# EAGLE design sweep board (EAGLE 8.4.3)
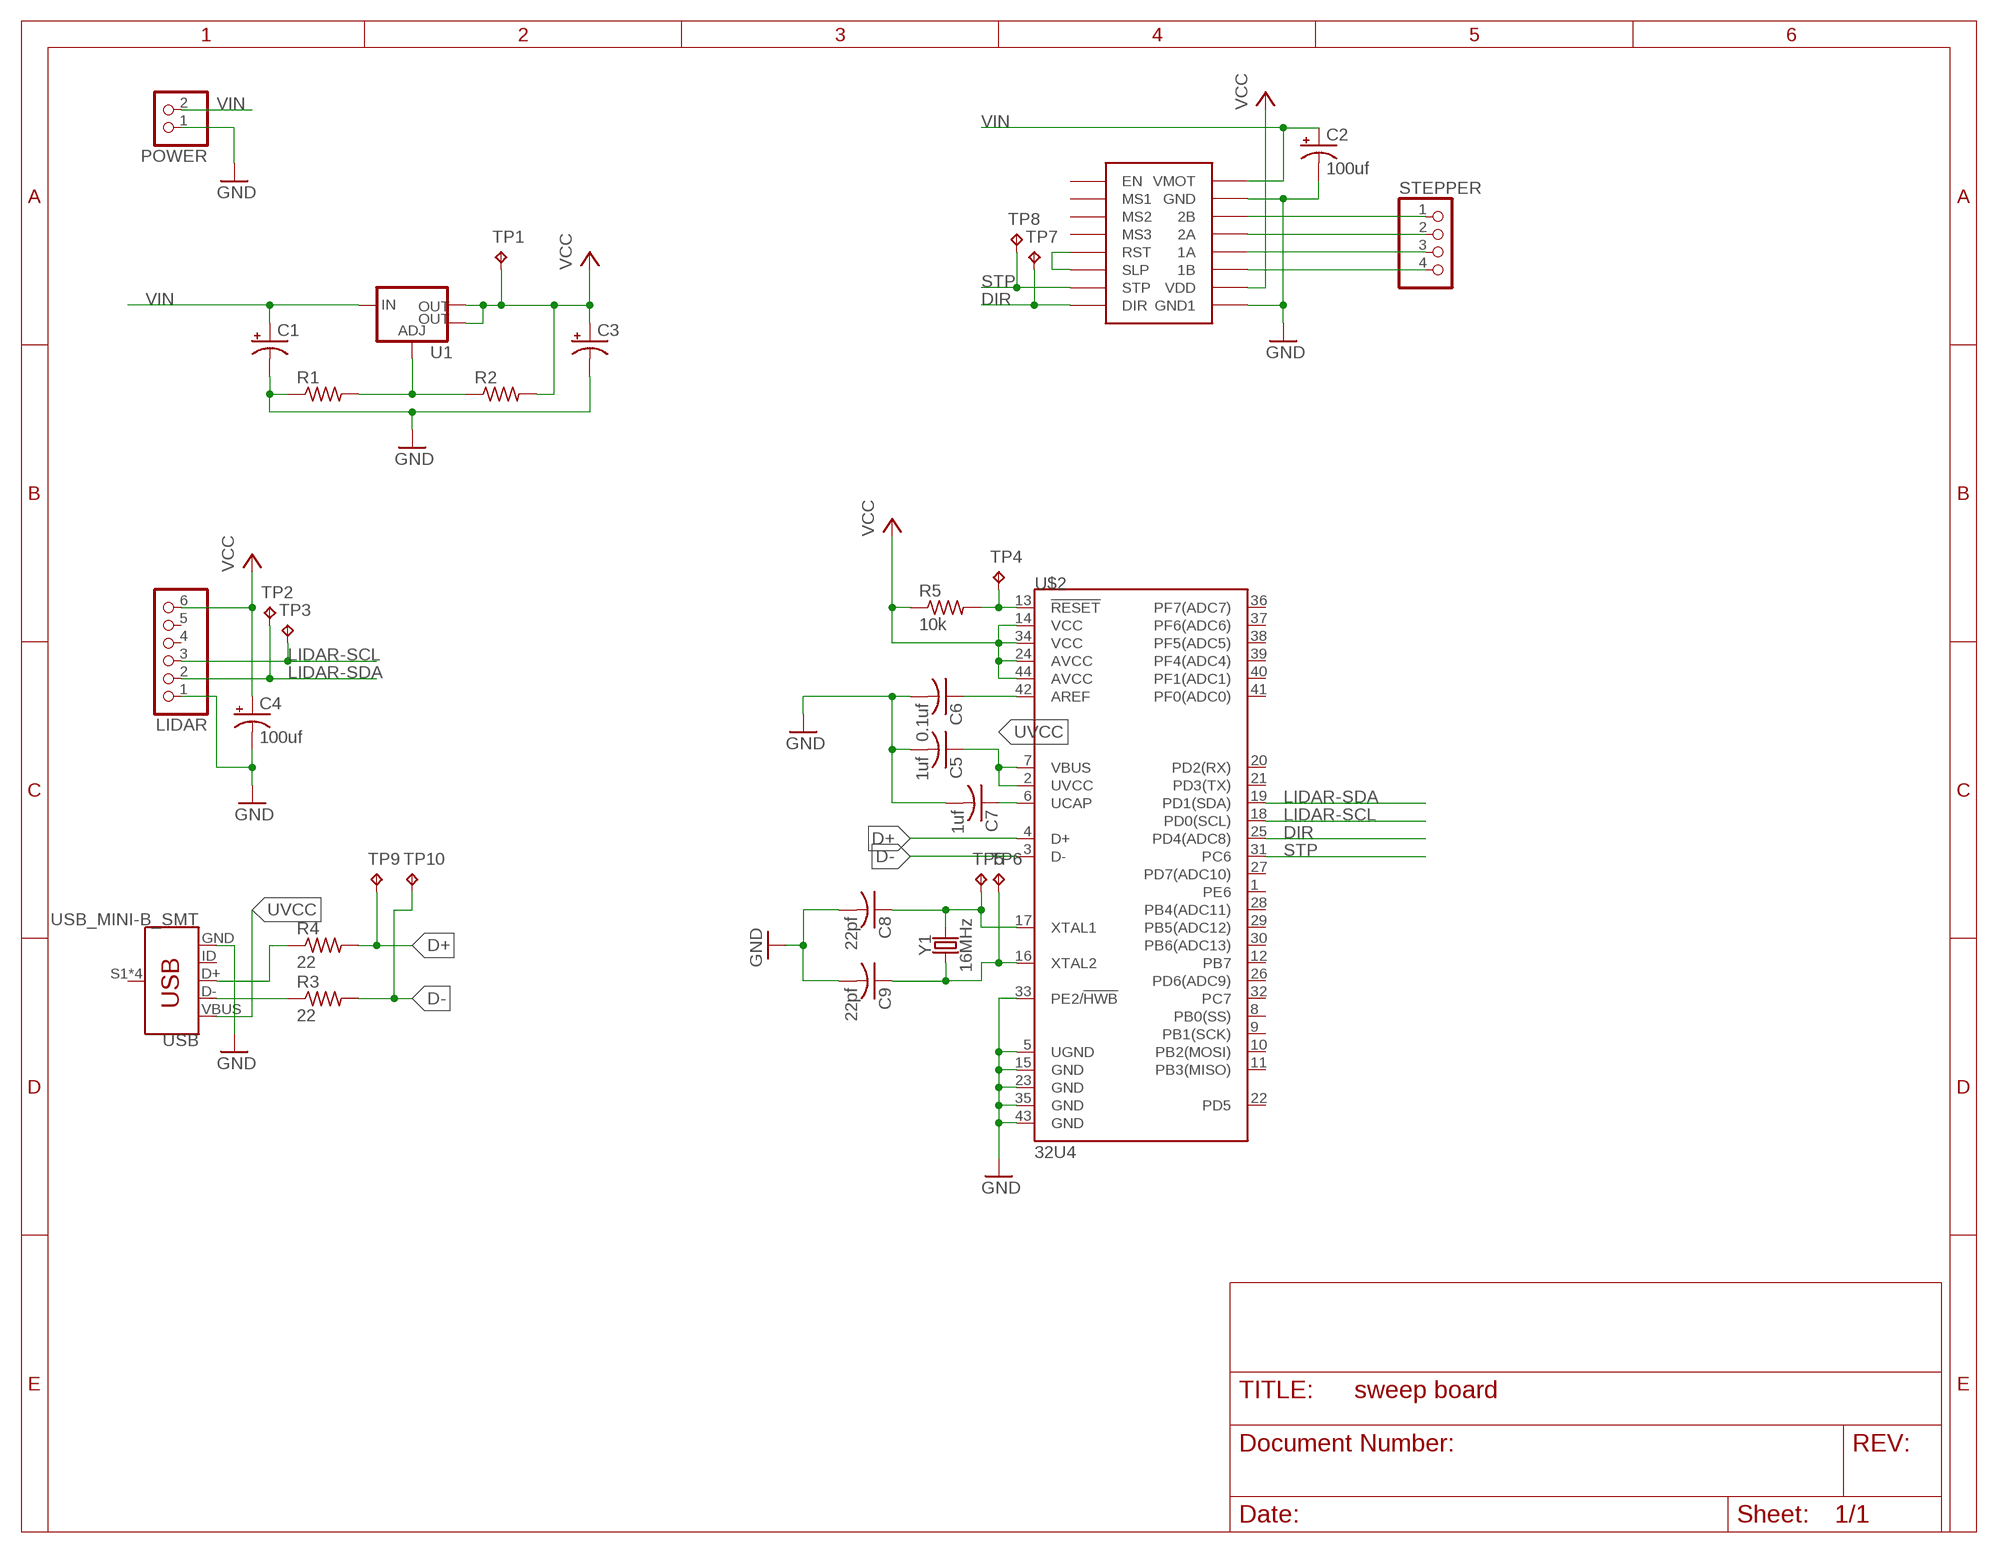
[diagram p0: schematic, sheet 1]

## Parts
C1  CPOL-USE2-5  [E2-5]
C2  100uf  CPOL-USE3.5-8  [E3,5-8]
C3  CPOL-USE3.5-8  [E3,5-8]
C4  100uf  CPOL-USE3.5-8  [E3,5-8]
C5  1uf  C-USC0603  [C0603]
C6  0.1uf  C-USC0603  [C0603]
C7  1uf  C-USC0603  [C0603]
C8  22pf  C-USC0603  [C0603]
C9  22pf  C-USC0603  [C0603]
LIDAR  PINHD-1X6  [1X06]
POWER  PINHD-1X2  [1X02]
R1  R-US_R0603  [R0603]
R2  R-US_R0603  [R0603]
R3  22  R-US_R0603  [R0603]
R4  22  R-US_R0603  [R0603]
R5  10k  R-US_R0603  [R0603]
STEPPER  PINHD-1X4  [1X04]
TP1  TPB1,27  [B1,27]
TP2  TPB1,27  [B1,27]
TP3  TPB1,27  [B1,27]
TP4  TPB1,27  [B1,27]
TP5  TPB1,27  [B1,27]
TP6  TPB1,27  [B1,27]
TP7  TPB1,27  [B1,27]
TP8  TPB1,27  [B1,27]
TP9  TPB1,27  [B1,27]
TP10  TPB1,27  [B1,27]
U1  V_REG_LM1117SOT223  [SOT223]
U$1  A4988  [A4988]
U$2  32U4  ATMEGA32U4TQFP-44  [TQFP44]
USB  USB_MINI-B_SMT  [USB-MINIB]
Y1  16MHz  CRYSTAL-16MHZSMD-5X3.2  [CRYSTAL-SMD-5X3.2-4PAD]

## Nets
D+: R4.2 TP9.TP U$2.4(D+)
D-: R3.2 TP10.TP U$2.3(D-)
DIR: TP7.TP U$1.P$8(DIR) U$2.25(PD4(ADC8))
GND: C1.- C2.- C3.- C4.- C5.2 C6.2 C7.2 C8.2 C9.2 LIDAR.1 POWER.1 R1.1 U$1.P$10(GND) U$1.P$16(GND1) U$2.5(UGND) U$2.15(GND) U$2.23(GND) U$2.33(PE2/!HWB) U$2.35(GND) U$2.43(GND) USB.GND
LIDAR-SCL: LIDAR.3 TP3.TP U$2.18(PD0(SCL))
LIDAR-SDA: LIDAR.2 TP2.TP U$2.19(PD1(SDA))
N$1: U$1.P$5(RST) U$1.P$6(SLP)
N$5: STEPPER.4 U$1.P$14(1B)
N$6: STEPPER.3 U$1.P$13(1A)
N$7: STEPPER.2 U$1.P$12(2A)
N$8: STEPPER.1 U$1.P$11(2B)
N$9: R3.1 USB.D-
N$10: R4.1 USB.D+
N$11: R1.2 R2.1 U1.1(ADJ)
N$12: R5.2 TP4.TP U$2.13(!RESET)
N$13: C6.1 U$2.42(AREF)
N$14: C7.1 U$2.6(UCAP)
N$15: C9.1 TP6.TP U$2.16(XTAL2) Y1.1
N$18: C8.1 TP5.TP U$2.17(XTAL1) Y1.3
STP: TP8.TP U$1.P$7(STP) U$2.31(PC6)
UVCC: C5.1 U$2.2(UVCC) U$2.7(VBUS) USB.VBUS
VCC: C3.+ C4.+ LIDAR.6 R2.2 R5.1 TP1.TP U1.2(OUT) U1.4(OUT) U$1.P$15(VDD) U$2.14(VCC) U$2.24(AVCC) U$2.34(VCC) U$2.44(AVCC)
VIN: C1.+ C2.+ POWER.2 U1.3(IN) U$1.P$9(VMOT)
Unconnected: LIDAR.4 LIDAR.5 U$1.P$1(EN) U$1.P$2(MS1) U$1.P$3(MS2) U$1.P$4(MS3) U$2.1(PE6) U$2.8(PB0(SS)) U$2.9(PB1(SCK)) U$2.10(PB2(MOSI)) U$2.11(PB3(MISO)) U$2.12(PB7) U$2.20(PD2(RX)) U$2.21(PD3(TX)) U$2.22(PD5) U$2.26(PD6(ADC9)) U$2.27(PD7(ADC10)) U$2.28(PB4(ADC11)) U$2.29(PB5(ADC12)) U$2.30(PB6(ADC13)) U$2.32(PC7) U$2.36(PF7(ADC7)) U$2.37(PF6(ADC6)) U$2.38(PF5(ADC5)) U$2.39(PF4(ADC4)) U$2.40(PF1(ADC1)) U$2.41(PF0(ADC0)) USB.ID USB.S1(SHIELD) USB.S2(SHIELD) USB.S3(SHIELD) USB.S4(SHIELD)

## Library data of the parts
C1-C4 = rcl:CPOL-US: POLARIZED CAPACITOR, American symbol; SPICEPREFIX: C
C5-C9 = rcl:C-US: CAPACITOR, American symbol; SPICEPREFIX: C
LIDAR = pinhead:PINHD-1X6: PIN HEADER
POWER = pinhead:PINHD-1X2: PIN HEADER
R1-R5 = rcl:R-US_: RESISTOR, American symbol; SPICEPREFIX: R
STEPPER = pinhead:PINHD-1X4: PIN HEADER
TP1-TP10 = testpad:TP: Test pad
U1 = SparkFun-IC-Power:V_REG_LM1117: Voltage Regulator LM1117 Standard adjustable voltage regulator but in SMD form. Spark Fun Electronics SKU : COM-00595; PROD_ID: VREG-08170
U$1 = JetsonProj:A4988
U$2 = SparkFun-IC-Microcontroller:ATMEGA32U4: Atmel MCU, 32KByte Atmel 44-pin 8-bit Microcontroller with 32KBytes of ISP Flash and USB Controller Datasheet <http://cdn.sparkfun.com/datasheets/Dev/Arduino/Boards/ATMega32U4.pdf> SparkFun Products LilyPad Arduino USB - ATmega32U4 Board <https://www.sparkfun.com/products/12049> (DEV-12049) Pro Micro - 5V/16MHz <https://www.sparkfun.com/products/12640> (DEV-12640) Pro Micro - 3.3V/8MHz <https://www.sparkfun.com/products/12587> (DEV-12587) Fio v3 - ATmega32U4 <https://www.sparkfun.com/products/11520> (DEV-11520) Qduino Mini <https://www.sparkfun.com/products/13614> (DEV-13614) Makey Makey - Standard Kit <https://www.sparkfun.com/products/11511> (WIG-11511) Makey Makey Deluxe Kit <https://www.sparkfun.com/products/11519> (WIG-11519); PROD_ID: IC-11161
USB = SparkFun-Connectors:USB_MINI-B: USB type Mini-B Connector Breaks out 5th pin, and includes shield pins if needed. SparkFun Products: SparkFun FTDI Basic Breakout <https://www.sparkfun.com/products/9716> SparkFun XBee Explorer USB <https://www.sparkfun.com/products/11812> SparkFun Redboard <https://www.sparkfun.com/products/12757>; PROD_ID: CONN-08193; SF_ID: PRT-00587
Y1 = SparkFun-Clocks:CRYSTAL-16MHZ: 16MHz Crystal Digikey Example <http://www.digikey.com/product-search/en?keywords=535-9122-1-ND> Frequency: 16MHz Frequency Stability: ±50ppm Frequency Tolerance: ±20ppm Load Capacitance: 18pF SparkFun Products: Pro Micro -5V/16MHz <https://www.sparkfun.com/products/12640> SparkFun Serial Enabled LCD Kit <https://www.sparkfun.com/products/10097>; PROD_ID: XTAL-08218; SF_ID: COM-00094

## Board
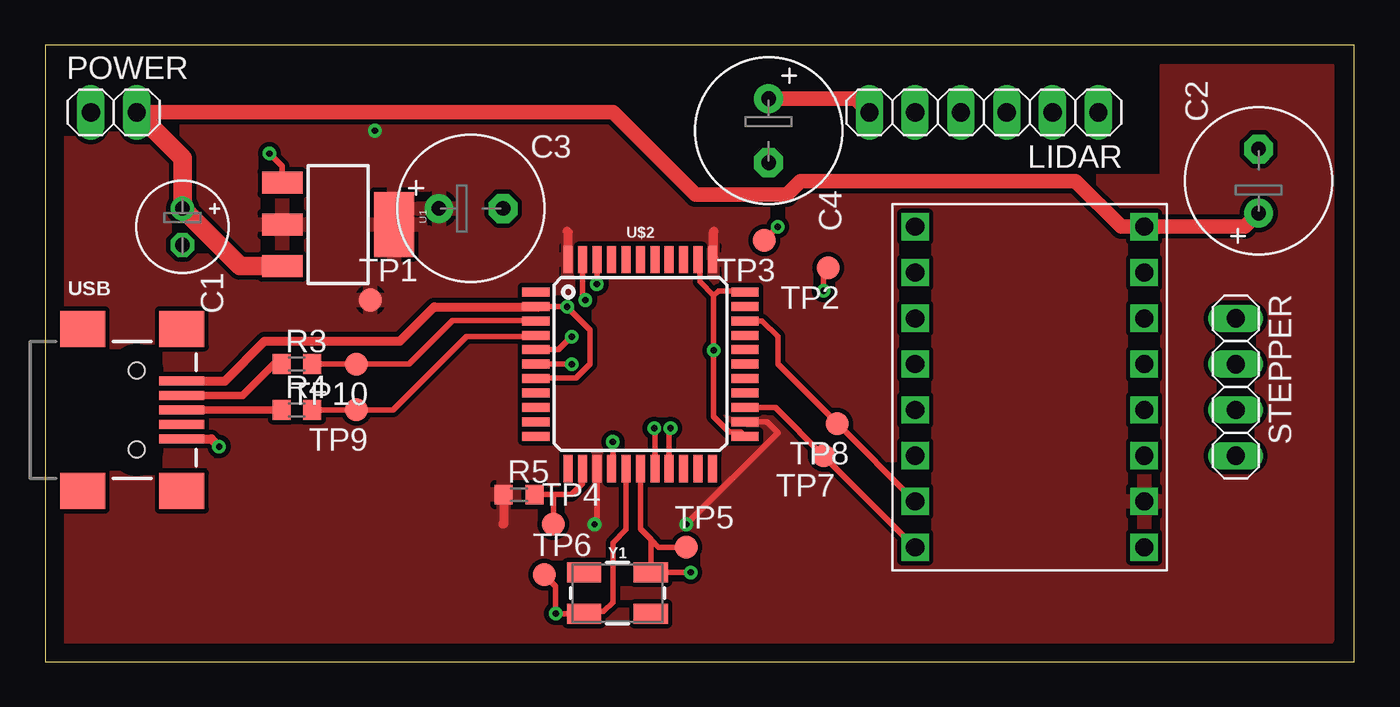
[diagram p1: board, top side]
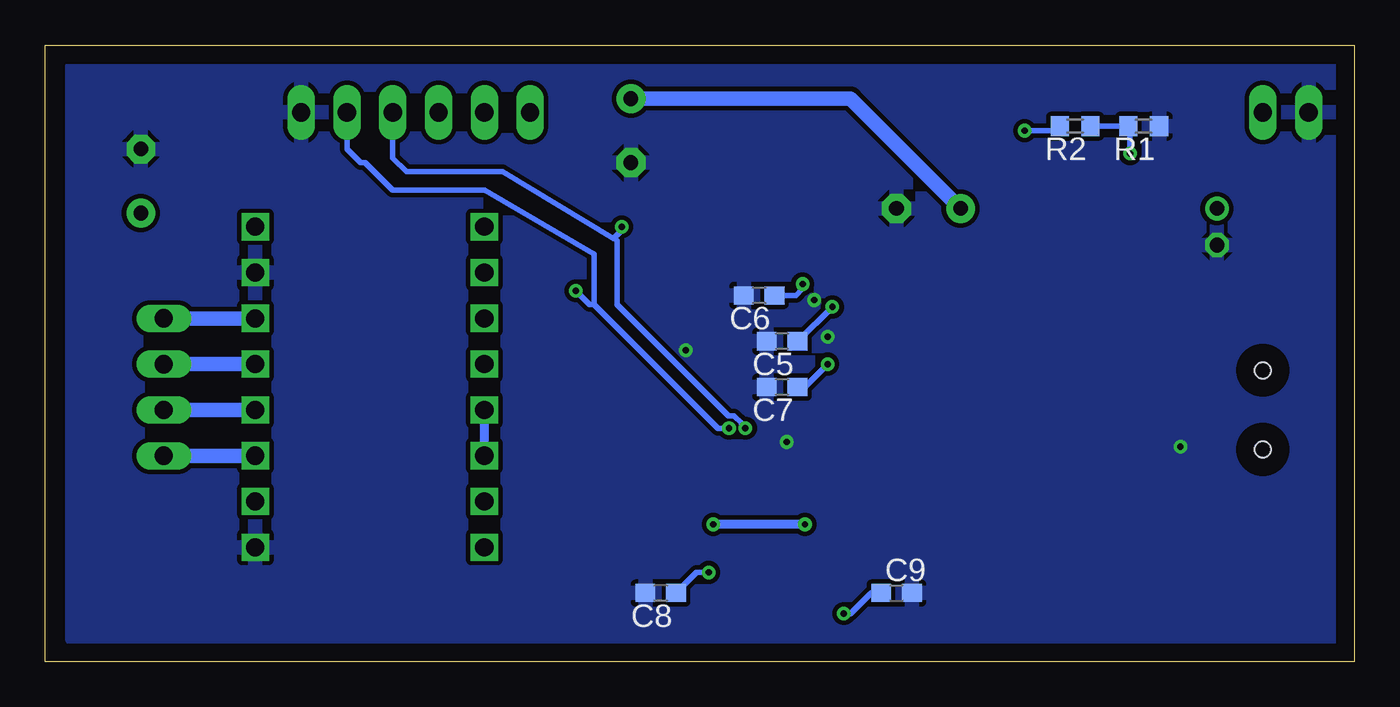
[diagram p2: board, bottom side, seen from below]

Size 72.62 x 34.21 mm. Coordinates in mm from the lower left corner, seen from the top.
Outline: 0,0 72.62,0 72.62,34.21 0,34.21 0,0
Copper layers (1*16): Top 0.035mm / dielectric 1.5mm / Bottom 0.035mm
Design rules "default": minimum track width 6mil, minimum drill 0.35mm, track to track 6mil, track to pad 6mil, pad to pad 6mil, via to via 6mil, smd to smd 6mil, copper to edge 40mil, drill to drill 6mil, minimum pad ring 10mil, minimum via ring 8mil, stop-mask expansion 4mil, vias tented up to drill 0mil, thermal gap 10mil

### Footprints (pad centres in the part's own frame; a part is rotated, then mirrored left to right if it is on the bottom)
E2-5 = drill 0.813 pad 1.27: + -1.016,0 | drill 0.813 pad 1.27 octagon: - 1.016,0
E3,5-8 = drill 0.813 pad 1.6: + -1.778,0 | drill 0.813 pad 1.6 octagon: - 1.778,0
C0603 = smd 1.1 x 1: 1 -0.85,0; 2 0.85,0
1X06 = drill 1.016 long: 1 -6.35,0; 2 -3.81,0; 3 -1.27,0; 4 1.27,0; 5 3.81,0; 6 6.35,0
1X02 = drill 1.016 long: 1 -1.27,0; 2 1.27,0
R0603 = smd 1 x 1.1: 1 -0.85,0; 2 0.85,0
1X04 = drill 1.016 long: 1 -3.81,0; 2 -1.27,0; 3 1.27,0; 4 3.81,0
B1,27 = smd 1.27 x 1.27: TP 0,0
SOT223 = smd 1.219 x 2.235: 1 -2.311,-3.099; 2 0,-3.099; 3 2.311,-3.099 | smd 3.6 x 2.2: 4 0,3.099
A4988 = drill 1 square: P$1 1.27,19.05; P$2 1.27,16.51; P$3 1.27,13.97; P$4 1.27,11.43; P$5 1.27,8.89; P$6 1.27,6.35; P$7 1.27,3.81; P$8 1.27,1.27; P$9 13.97,19.05; P$10 13.97,16.51; P$11 13.97,13.97; P$12 13.97,11.43; P$13 13.97,8.89; P$14 13.97,6.35; P$15 13.97,3.81; P$16 13.97,1.27
TQFP44 = smd 1.5 x 0.5: 1 -5.8,4; 2 -5.8,3.2; 3 -5.8,2.4; 4 -5.8,1.6; 5 -5.8,0.8; 6 -5.8,0; 7 -5.8,-0.8; 8 -5.8,-1.6; 9 -5.8,-2.4; 10 -5.8,-3.2; 11 -5.8,-4; 23 5.8,-4; 24 5.8,-3.2; 25 5.8,-2.4; 26 5.8,-1.6; 27 5.8,-0.8; 28 5.8,0; 29 5.8,0.8; 30 5.8,1.6; 31 5.8,2.4; 32 5.8,3.2; 33 5.8,4 | smd 0.5 x 1.5: 12 -4,-5.8; 13 -3.2,-5.8; 14 -2.4,-5.8; 15 -1.6,-5.8; 16 -0.8,-5.8; 17 0,-5.8; 18 0.8,-5.8; 19 1.6,-5.8; 20 2.4,-5.8; 21 3.2,-5.8; 22 4,-5.8; 34 4,5.8; 35 3.2,5.8; 36 2.4,5.8; 37 1.6,5.8; 38 0.8,5.8; 39 0,5.8; 40 -0.8,5.8; 41 -1.6,5.8; 42 -2.4,5.8; 43 -3.2,5.8; 44 -4,5.8
USB-MINIB = smd 2.5 x 0.5: D+ 2.5,0; D- 2.5,0.8; GND 2.5,-1.6; ID 2.5,-0.8; VBUS 2.5,1.6 | smd 2.5 x 2: S1 -3,4.5; S2 2.5,4.5; S3 -3,-4.5; S4 2.5,-4.5 | hole 0.9: 0,2.2; 0,-2.2
CRYSTAL-SMD-5X3.2-4PAD = smd 1.9 x 1.1: 1 -1.85,-1.15; 2 1.85,-1.15; 3 1.85,1.15; 4 -1.85,1.15

### Placement (x,y rotation side)
C1  7.62,24.13 270 top
C2  67.31,26.67 90 top
C3  23.62,25.15 0 top
C4  40.13,29.46 270 top
C5  31.75,17.78 180 bottom
C6  33.02,20.32 180 bottom
C7  31.75,15.24 180 bottom
C8  38.48,3.81 180 bottom
C9  25.4,3.81 0 bottom
LIDAR  52.07,30.48 180 top
POWER  3.81,30.48 0 top
R1  11.68,29.72 180 bottom
R2  15.49,29.72 180 bottom
R3  13.97,16.51 0 top
R4  13.97,13.97 0 top
R5  26.29,9.27 0 top
STEPPER  66.04,15.24 270 top
TP1  18.03,20.07 0 top
TP2  43.43,21.84 180 top
TP3  39.88,23.37 180 top
TP4  28.19,7.62 0 top
TP5  35.56,6.35 0 top
TP6  27.69,4.83 0 top
TP7  43.18,11.43 180 top
TP8  43.94,13.21 180 top
TP9  17.27,13.97 180 top
TP10  17.27,16.51 180 top
U1  16.26,24.26 270 top
U$1  46.99,5.08 0 top
U$2  33.02,16.51 0 top
USB  5.08,13.97 0 top
Y1  31.75,3.81 0 top

### Tracks (layer width: path | path; a pad name or v marks a point on that pad's centre or on a via)
D+
  Top 0.305: U$2.4 27.14,18.03 23.37,18.03 19.3,13.97 TP9.TP R4.2
D-
  Top 0.305: 18.03,16.51 R3.2 | 18.03,16.51 20.19,16.51 22.61,18.92 27.21,18.92 U$2.3 | TP10.TP 18.03,16.51
DIR
  Top 0.305: U$1.P$8 TP7.TP 40.5,14.11 U$2.25
GND  (via drill 0.35)
  Top 0.305: U$2.23 38.58,12.76 37.94,12.76 37.08,13.62 v37.08,17.27 37.08,20.32 | U$2.33 38.76,20.57 37.34,20.57 37.08,20.32 | U$2.35 36.32,22.21 36.32,21.08 37.08,20.32 | U$2.43 29.82,20.22 v29.97,20.07 | U$2.5 28.49,17.31 v29.21,18.03 | U$2.15 31.5,10.79 v31.5,12.19
  Top 0.508: USB.GND 9.22,12.37 v9.65,11.94
  pour Bottom (isolate 0.254): 1.27,33.02 1.27,1.27 71.12,1.27 71.12,33.02
LIDAR-SCL  (via drill 0.35)
  Top 0.305: U$2.18 33.82,12.66 33.78,12.7 v33.78,12.95 | v40.64,24.13 TP3.TP
  Bottom 0.305: LIDAR.3 53.34,27.94 52.58,27.18 47.24,27.18 41.08,23.48 | 41.08,23.48 40.89,23.37 40.89,19.81 34.72,13.64 34.41,13.64 34.01,13.24 34.01,13.18 v33.78,12.95 | 41.08,23.48 40.64,23.92 v40.64,24.13
LIDAR-SDA  (via drill 0.35)
  Top 0.305: U$2.19 34.62,12.88 v34.69,12.95 | v43.18,20.57 43.18,21.59 TP2.TP
  Bottom 0.305: v34.69,12.95 35.31,12.95 42.16,19.81 | 42.16,19.81 42.16,22.61 48.26,26.16 53.34,26.16 54.86,27.69 55.12,27.69 55.88,28.45 LIDAR.2 | 42.16,19.81 42.42,19.81 v43.18,20.57
N$1
  Bottom 0.508: U$1.P$6 U$1.P$5
N$5
  Bottom 0.813: STEPPER.4 U$1.P$14
N$6
  Bottom 0.813: U$1.P$13 STEPPER.3
N$7
  Bottom 0.813: STEPPER.2 U$1.P$12
N$8
  Bottom 0.813: STEPPER.1 U$1.P$11
N$9
  Top 0.406: USB.D- 10.96,14.77 12.7,16.51 R3.1
N$10
  Top 0.406: USB.D+ R4.1
N$11  (via drill 0.35)
  Top 0.305: U1.1 13.16,27.48 v12.45,28.19
  Bottom 0.305: v12.45,28.19 12.45,29.63 R1.2 R2.1
N$12
  Top 0.305: U$2.13 29.82,9.88 29.21,9.27 28.19,9.27 | 28.19,9.27 R5.2 | TP4.TP 28.19,9.27
N$13  (via drill 0.35)
  Top 0.305: U$2.42 30.62,20.97 v30.61,20.95
  Bottom 0.305: v30.61,20.95 30.61,20.7 30.99,20.32 C6.1
N$14  (via drill 0.35)
  Top 0.305: U$2.6 v29.21,16.51
  Bottom 0.305: v29.21,16.51 30.48,15.24 C7.1
N$15  (via drill 0.35)
  Top 0.305: U$2.16 32.22,7.33 31.5,6.6 31.5,3.3 30.99,2.79 30.03,2.79 Y1.1 v28.33,2.66 v28.32,2.67 28.32,4.19 TP6.TP
  Bottom 0.305: C9.1 26.8,3.81 27.94,2.67 v28.32,2.67
N$18  (via drill 0.35)
  Top 0.305: v35.81,4.95 v35.81,4.96 Y1.3 33.6,6.79 | 33.6,6.79 33.02,7.37 U$2.17 | TP5.TP 34.04,6.35 33.6,6.79
  Bottom 0.305: C8.1 36.49,4.95 v35.81,4.95
STP
  Top 0.305: U$1.P$7 TP8.TP 40.64,16.51 40.64,18.03 39.76,18.91 U$2.31
UVCC  (via drill 0.35)
  Top 0.305: U$2.2 27.43,19.71 28.93,19.71 v28.96,19.68 30.23,18.41 30.23,16.51 29.46,15.75 27.26,15.75 U$2.7
  Top 0.508: USB.VBUS 9.98,15.57 12.19,17.78 19.68,17.78 21.59,19.68 27.41,19.68 27.43,19.71
  Bottom 0.305: v28.96,19.68 30.86,17.78 C5.1
VCC  (via drill 0.35)
  Top 0.305: U$2.14 30.62,7.76 v30.48,7.62 | U$2.24 40.03,13.31 40.64,12.7 v35.56,7.62
  Top 0.508: R5.1 25.44,7.66 25.4,7.62 | U$2.44 29.02,23.81 28.96,23.88 | U$2.34 37.08,22.37 37.08,23.88
  Top 0.813: LIDAR.6 44.96,31.24 C4.+
  Bottom 0.305: R2.2 16.6,29.46 v18.29,29.46
  Bottom 0.508: v30.48,7.62 v35.56,7.62
  Bottom 0.813: C3.+ 27.94,31.24 C4.+
  pour Top (isolate 0.254): 1.27,33.02 35.56,33.02 36.83,33.02 36.83,26.67 62.23,26.67 62.23,33.02 71.12,33.02 71.12,1.27 1.27,1.27
VIN
  Top 0.813: C2.+ 66.55,24.13 U$1.P$9 59.69,24.13 57.15,26.67 41.91,26.67 41.15,25.91 36.07,25.91 31.5,30.48 POWER.2
  Top 1.016: POWER.2 7.62,27.94 C1.+ 10.82,21.95 U1.3